# Altium schematic sheet Power_Supply.SchDoc
size 431 x 279 mm; Organization: ORGANIZATION; Address1: ADDRESS 1; Address2: ADDRESS 2; Address3: ADDRESS 3; Address4: ADDRESS 4; Revision: -; SheetNumber: 5; SheetTotal: 5; ENG_APP_DATE: --/--/--; DSN_APP_DATE: --/--/--; CHK_APP_DATE: --/--/--
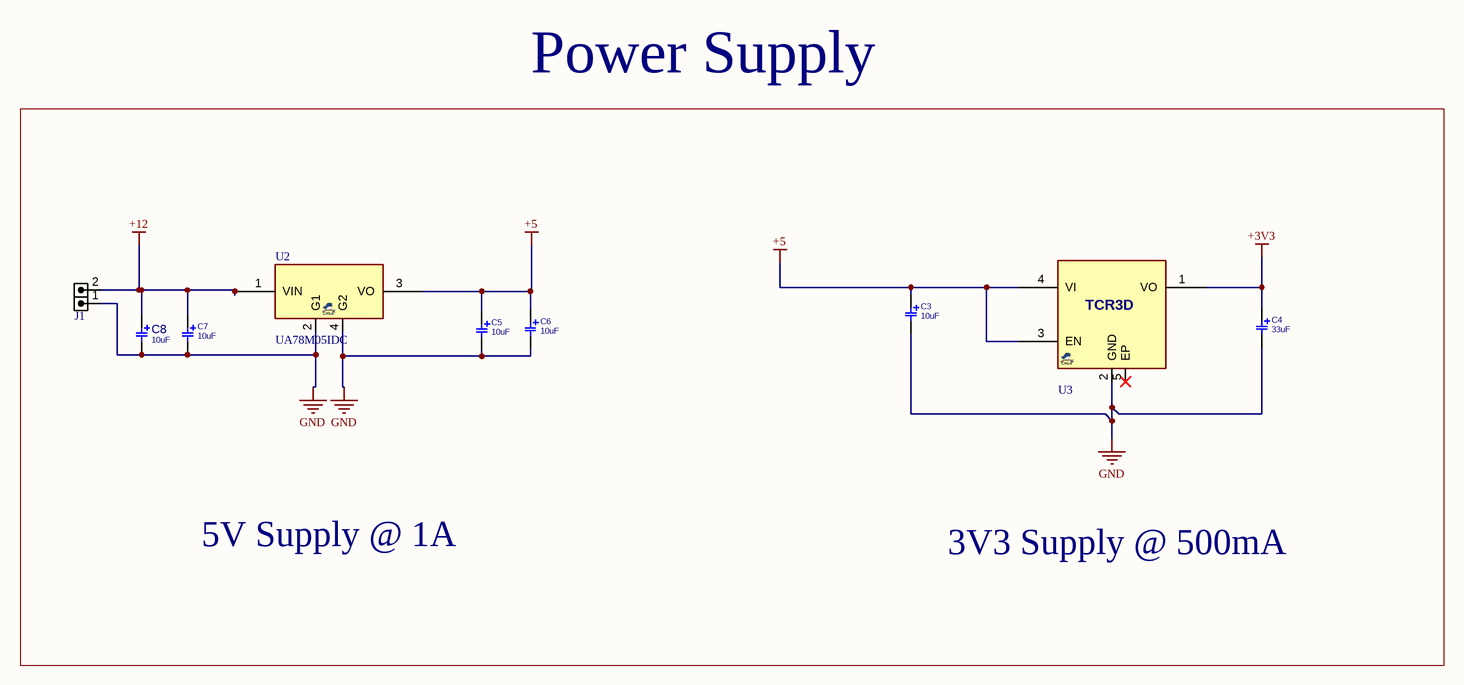
[diagram p0: Power_Supply.SchDoc]

## Parts
C3  10uF  [C_TN_3216]
C4  33uF  [C_TN_3216]
C5  10uF  [C_TN_3216]
C6  10uF  [C_TN_3216]
C7  10uF  [C_TN_3216]
C8  10uF  [C_EL_8]
J1  HDRM2  [HDR_M_1X2]  (value not drawn)
U2  UA78M05IDC  [SOT223_4]
U3  TCR3D  [SON65_4T_1010]  (value not drawn)

## Nets
+3V3: C4.1 U3.1(VO)
+5: C3.1 C5.1 C6.1 U2.3(VO) U3.3(EN) U3.4(VI)
+12: C7.1 C8.1 J1.2 U2.1(VIN)
GND: C3.2 C4.2 C5.2 C6.2 C7.2 C8.2 J1.1 U2.2(G1) U2.4(G2) U3.2(GND)

Not connected (* = marked no-connect by the designer): U3 5(EP)*

## Notes on the sheet
- Power Supply
- 5V Supply @ 1A
- 3V3 Supply @ 500mA
- DWG. NO.
- REV.
- SHT.
- THIS DOCUMENT AND THE DATA DISCLOSED HEREIN OR HEREWITH IS THE PROPERTY OF ALTIUM LIMITED AND MAY BE FREELY DISTRIBUTED IN WHOLE. NO RIGHTS ARE RESERVED OR EXPRESS OR IMPLIED WARANTEE GIVEN.
- REVISION
- DESCRIPTION
- DATE
- APPROVED
- ENG:
- APPROVALS
- PROJECT
- DSN:
- CHK:
- REFERENCE DOCUMENTS
- PROJECT REVISION:
- TITLE
- DOCUMENT REVISION:
- DESIGN ITEM:
- BOM:
- FAB DWG:
- PCB DWG:
- ASSY DWG:
- SCALE:
- SIZE
- B
- CAGE CODE
- FILE NAME
- DWG NO.
- SHEET
- OF
- REV

## Library data of the parts
C3-C7 = CAP_SMD_TAN_3216: CAP, SMD, TAN,; PARAM2: -V
  C3 C5-C7: VALUE: 10uF
  C4: VALUE: 33uF
C8 = CAP_SMD_EL: CAP, THD, ELEC,; MANF_P#: MANF_PART#; PARAM2: -V; DESC: DESCRIPTION; DIST#: MOUSER; PARAM: 20%; PRICE: 10= -$; MANF: MANF; ASSEMBLY: ASSEMBLY; VALUE: 10uF
J1 = HDR_M_1X2: CONN, HEADER, Male, pitch: 2.54mm, 2POS; VALUE: HDRM2
U2 = VREG_78M05_SOT223: REG, Linear, Fixed, 5v, 0.5A, SOT-223; MANF_P#: UA78M05IDCYR; MANF: TI; PARAM: 5v, 0.5A; PARAM2: PARAM2; VALUE: UA78M05IDC
U3 = VREG_TCR3D_DFN4: REG, Linear, LDO0.3V, Fixed, 300mA, VIN2~5.25V, VOUT1~4.5V,DFN4 1X1mm; MANF: TOSHIBA; MANF_P#: TCR3DM10, TCR3DM105, TCR3DM12, TCR3DM15, TCR3DM18, TCR3DM25, TCR3DM33; PARAM2: 70dB PSRR; PARAM: LDO0.2V, Fixed, 300mA; PRICE: $0.3; VALUE: TCR3D